# Altium project AMC_FMC_Carrier.PrjPcb (part 4 of 7)

## Sheet UI_mon.SchDoc
size A4; DocumentNumber: 28; SheetNumber: 28; SheetTotal: 30
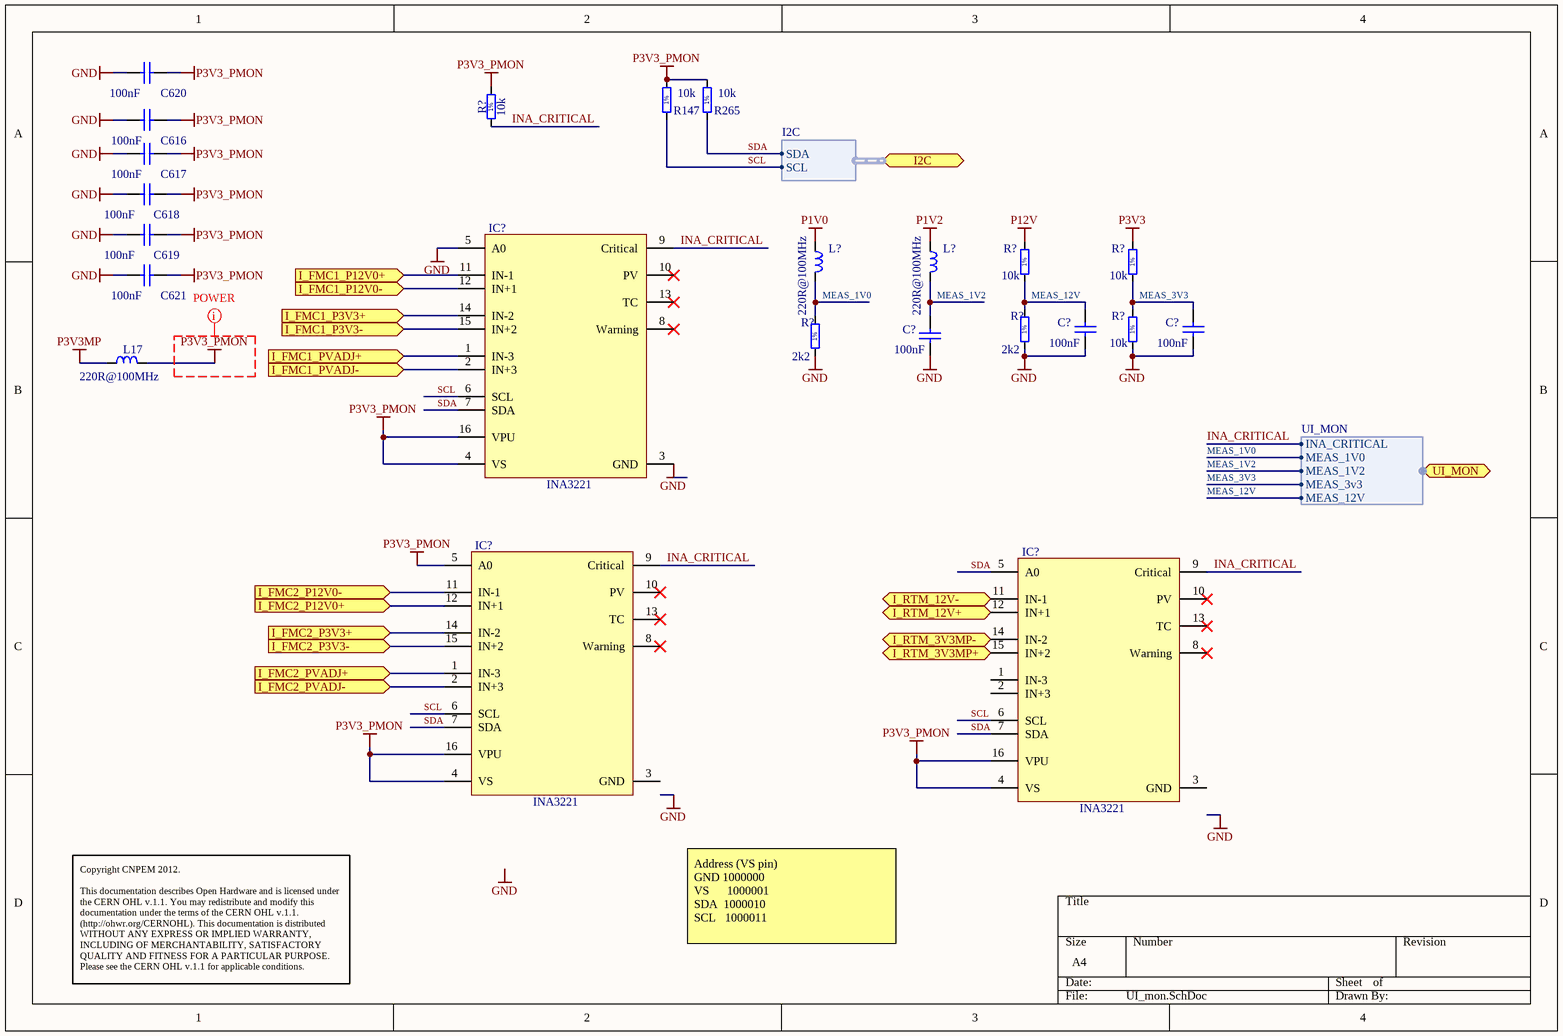
[diagram p9: UI_mon.SchDoc]

### Parts
(Parts that share a designator on the sheet are numbered #1, #2 ... from top to bottom, then left to right.)
C616  100nF  [CAPC0603X33N]
C617  100nF  [CAPC0603X33N]
C618  100nF  [CAPC0603X33N]
C619  100nF  [CAPC0603X33N]
C620  100nF  [CAPC0603X33N]
C621  100nF  [CAPC0603X33N]
C?#1  100nF  [CAPC0603X33N]
C?#2  100nF  [CAPC0603X33N]
C?#3  100nF  [CAPC0603X33N]
IC?#2  INA3221  [PQFN65P400X400X150-17N-S243]
IC?#3  INA3221  [PQFN65P400X400X150-17N-S243]
IC?#4  INA3221  [PQFN65P400X400X150-17N-S243]
L17  220R@100MHz  [INDC2012X105N]
L?#1  220R@100MHz  [INDC2012X105N]
L?#2  220R@100MHz  [INDC2012X105N]
R147  10k  [RESC1005X40N]
R265  10k  [RESC1005X40N]
R?#5  10k  [RESC1608X55N]
R?#6  10k  [RESC1005X40N]
R?#7  10k  [RESC1005X40N]
R?#8  2k2  [RESC1005X40N]
R?#9  10k  [RESC1005X40N]
R?#10  2k2  [RESC1005X40N]

### Ports
I2C (harness I2C), I_FMC1_P3V3+ (in), I_FMC1_P3V3- (in), I_FMC1_P12V0+ (in), I_FMC1_P12V0- (in), I_FMC1_PVADJ+ (in), I_FMC1_PVADJ- (in), I_FMC2_P3V3+ (in), I_FMC2_P3V3- (in), I_FMC2_P12V0+ (in), I_FMC2_P12V0- (in), I_FMC2_PVADJ+ (in), I_FMC2_PVADJ- (in), I_RTM_3V3MP+ (in), I_RTM_3V3MP- (in), I_RTM_12V+ (in), I_RTM_12V- (in), UI_MON (harness UI_MON)

### Harnesses
I2C: SCL, SDA
UI_MON: INA_CRITICAL, MEAS_1V0, MEAS_12V, MEAS_1V2, MEAS_3v3

### Nets
GND: C616.2 C617.2 C618.2 C619.2 C620.2 C621.2 C?#1.1 C?#2.1 C?#3.1 IC?#2.3(GND) IC?#2.5(A0) R?#8.1 R?#9.1 R?#10.1
P1V0: L?#1.1
P1V2: L?#2.1
P3V3: R?#7.2
P3V3_PMON: C616.1 C617.1 C618.1 C619.1 C620.1 C621.1 IC?#2.4(VS) IC?#2.16(VPU) IC?#3.4(VS) IC?#3.5(A0) IC?#3.16(VPU) IC?#4.4(VS) IC?#4.16(VPU) L17.2 R147.2 R265.2 R?#5.2
P3V3MP: L17.1
P12V: R?#6.2
I_FMC1_P3V3n: IC?#2.15(IN+2) ; port I_FMC1_P3V3-
I_FMC1_P3V3p: IC?#2.14(IN-2) ; port I_FMC1_P3V3+
I_FMC1_P12V0+: IC?#2.11(IN-1) ; port I_FMC1_P12V0+
I_FMC1_P12V0-: IC?#2.12(IN+1) ; port I_FMC1_P12V0-
I_FMC1_PADJn: IC?#2.2(IN+3) ; port I_FMC1_PVADJ-
I_FMC1_PADJp: IC?#2.1(IN-3) ; port I_FMC1_PVADJ+
I_FMC2_P3V3n: IC?#3.15(IN+2) ; port I_FMC2_P3V3-
I_FMC2_P3V3p: IC?#3.14(IN-2) ; port I_FMC2_P3V3+
I_FMC2_P12V0+: IC?#3.12(IN+1) ; port I_FMC2_P12V0+
I_FMC2_P12V0-: IC?#3.11(IN-1) ; port I_FMC2_P12V0-
I_FMC2_PADJn: IC?#3.2(IN+3) ; port I_FMC2_PVADJ-
I_FMC2_PADJp: IC?#3.1(IN-3) ; port I_FMC2_PVADJ+
I_RTM_P3V3MP+: IC?#4.15(IN+2) ; port I_RTM_3V3MP+
I_RTM_P3V3MP-: IC?#4.14(IN-2) ; port I_RTM_3V3MP-
I_RTM_P12V+: IC?#4.12(IN+1) ; port I_RTM_12V+
I_RTM_P12V-: IC?#4.11(IN-1) ; port I_RTM_12V-
INA_CRITICAL: IC?#2.9(Critical) IC?#3.9(Critical) IC?#4.9(Critical) R?#5.1 ; port UI_MON.INA_CRITICAL  [project net UI_MON.INA_CRITICAL]
MEAS_1V0: L?#1.2 R?#10.2 ; port UI_MON.MEAS_1V0  [project net UI_MON.MEAS_1V0]
MEAS_1V2: C?#3.2 L?#2.2 ; port UI_MON.MEAS_1V2  [project net UI_MON.MEAS_1V2]
MEAS_3V3: C?#2.2 R?#7.1 R?#9.2 ; port UI_MON.MEAS_3v3  [project net UI_MON.MEAS_3v3]
MEAS_12V: C?#1.2 R?#6.1 R?#8.2 ; port UI_MON.MEAS_12V  [project net UI_MON.MEAS_12V]
SCL: IC?#2.6(SCL) IC?#3.6(SCL) IC?#4.6(SCL) R147.1 ; port I2C.SCL  [project net I2C_CPU.SCL]
SDA: IC?#2.7(SDA) IC?#3.7(SDA) IC?#4.5(A0) IC?#4.7(SDA) R265.1 ; port I2C.SDA  [project net I2C_CPU.SDA]

Not connected (* = marked no-connect by the designer): IC?#2 8(Warning)* 10(PV)* 13(TC)*; IC?#3 3(GND) 8(Warning)* 10(PV)* 13(TC)*; IC?#4 1(IN-3) 2(IN+3) 3(GND) 8(Warning)* 10(PV)* 13(TC)*

### Layout directives
net class POWER: P3V3_PMON

### Notes on the sheet
- Copyright CNPEM 2012.
  This documentation describes Open Hardware and is licensed under the CERN OHL v.1.1. You may redistribute and modify this documentation under the terms of the CERN OHL v.1.1. (http://ohwr.org/CERNOHL). This documentation is distributed WITHOUT ANY EXPRESS OR IMPLIED WARRANTY, INCLUDING OF MERCHANTABILITY, SATISFACTORY QUALITY AND FITNESS FOR A PARTICULAR PURPOSE. Please see the CERN OHL v.1.1 for applicable conditions.
- Address (VS pin)
  GND 1000000
  VS      1000001
  SDA  1000010
  SCL   1000011
- Labels drawn without touching a wire or pin: GND
- (in symbol R0402_2K2_1%_0.0625W_100PPM) 1%
- (in symbol R0402_10K_1%_0.0625W_100PPM) 1%
- (in symbol R0603_10K_1%_0.1W_100PPM) 1%

### Library data of the parts
C616-C621 C?#1-C?#3 = CC0201_100NF_6.3V_10%_X5R: Non-polarised capacitor; Part Description: SMD Multilayer Chip Ceramic Capacitor; Manufacturer: GENERIC; Manufacturer1 Part Number: 02016D104KAT2A; Voltage: 6.3V; TC: X5R; Tolerance: ±10%; Table: Capacitors SMD; Part Number: CC0201_100NF_6.3V_10%_X5R; Component Kind: Standard; Component Type: Standard; Pin Count: 2; Value: 100nF; Status: Not Recommended; Manufacturer Part Number: CC0201_100NF_6.3V_10%_X5R; Case: 0201; Mounted: Yes; Socket: No; SMD: Yes; Manufacturer1 Example: AVX; Manufacturer1 ComponentHeight: 0.33mm; HelpURL: \\cern.ch\dfs\Applications\Altium\Datasheets\CC0201_X5R_AVX.pdf; Author: CERN DEM JLC; CreateDate: 2007-12-03; LatestRevisionDate: 2007-12-03
IC?#2-IC?#4 = INA3221: Triple-Channel, High-Side Measurement, Shunt and Bus Voltage Monitor  with I  2C™ Interface
L17 = IND0805_MURATA_BLM21PG221SN1D: Inductor; Part Description: SMD EMIFIL Suppression Chip Bead Ferrite; Manufacturer: MURATA; Power: 2A; Resistance: 0.05R; Tolerance: ±25%; Table: Inductors SMD; Part Number: IND0805_MURATA_BLM21PG221SN1D; Component Kind: Standard; Component Type: Standard; Pin Count: 2; Value: 220R@100MHz; Status: None; Manufacturer Part Number: BLM21PG221SN1D; Case: 0805; Mounted: Yes; Socket: No; SMD: Yes; ComponentHeight: 1.05mm; HelpURL: \\cern.ch\dfs\Applications\Altium\Datasheets\IND0402_MURATA_BLM21P.pdf; Author: CERN DEM JLC; CreateDate: 25/01/2010; LatestRevisionDate: 25/01/2010
L?#1 L?#2 = IND0805_MURATA_BLM21PG221SN1D: Inductor; Part Description: SMD EMIFIL Suppression Chip Ferrite Bead; Manufacturer: MURATA; Power: 2A; Resistance: 0.05R; Tolerance: ±25%; Table: Inductors SMD; Part Number: IND0805_MURATA_BLM21PG221SN1D; Component Kind: Standard; Component Type: Standard; Pin Count: 2; Value: 220R@100MHz; Status: None; Manufacturer Part Number: BLM21PG221SN1D; Case: 0805; Mounted: Yes; Socket: No; SMD: Yes; ComponentHeight: 1.05mm; HelpURL: \\cern.ch\dfs\Applications\Altium\Datasheets\IND0402_MURATA_BLM21P.pdf; Author: CERN DEM JLC; CreateDate: 2010-01-25; LatestRevisionDate: 2010-01-25
R147 R265 R?#6 R?#7 R?#9 = R0402_10K_1%_0.0625W_100PPM: Resistor - 1%; Part Description: General Purpose Thick Film Chip Resistor; Manufacturer: GENERIC; Manufacturer1 Part Number: 232270671003L; TC: ±100ppm/°C; Table: Resistors SMD; Part Number: R0402_10K_1%_0.0625W_100PPM; Component Kind: Standard; Component Type: Standard; Pin Count: 2; Value: 10k; Status: Not recommended; Power: 0.0625W; Tolerance: ±1%; Manufacturer Part Number: R0402_10K_1%_0.0625W_100PPM; Case: 0402; Mounted: Yes; Socket: No; SMD: Yes; Manufacturer1 Example: YAGEO PHYCOMP; Manufacturer1 ComponentHeight: 0.4mm; HelpURL: \\cern.ch\dfs\Applications\Altium\Datasheets\R0402_Phycomp_RC0402.pdf; Author: CERN DEM JLC; CreateDate: 2007-12-03; LatestRevisionDate: 2012-10-17
R?#5 = R0603_10K_1%_0.1W_100PPM: Resistor - 1%; Part Description: General Purpose Thick Film Chip Resistor; Manufacturer: GENERIC; Manufacturer1 Part Number: NRC06F1002TRF; Power: 0.1W; TC: ±100ppm/°C; Part Number: R0603_10K_1%_0.1W_100PPM; Component Kind: Standard; Component Type: Standard; Pin Count: 2; Value: 10k; Status: Preferred; Tolerance: ±1%; Manufacturer Part Number: R0603_10K_1%_0.1W_100PPM; Case: 0603; Mounted: Yes; Sense: No; Socket: No; SMD: Yes; Manufacturer1 Example: NIC COMPONENT; Manufacturer1 ComponentHeight: 0.55mm; HelpURL: \\cern.ch\dfs\Applications\Altium\Datasheets\R0603_NIC_NRC.pdf; Author: CERN DEM JLC; CreateDate: 03/12/2007; LatestRevisionDate: 13/03/2008
R?#8 R?#10 = R0402_2K2_1%_0.0625W_100PPM: Resistor - 1%; Part Description: General Purpose Thick Film Chip Resistor; Manufacturer: GENERIC; Manufacturer1 Part Number: 232270672202L; TC: ±100ppm/°C; Table: Resistors SMD; Part Number: R0402_2K2_1%_0.0625W_100PPM; Component Kind: Standard; Component Type: Standard; Pin Count: 2; Value: 2k2; Status: Not recommended; Power: 0.0625W; Tolerance: ±1%; Manufacturer Part Number: R0402_2K2_1%_0.0625W_100PPM; Case: 0402; Mounted: Yes; Socket: No; SMD: Yes; Manufacturer1 Example: YAGEO PHYCOMP; Manufacturer1 ComponentHeight: 0.4mm; HelpURL: \\cern.ch\dfs\Applications\Altium\Datasheets\R0402_Phycomp_RC0402.pdf; Author: CERN DEM JLC; CreateDate: 2007-12-03; LatestRevisionDate: 2012-10-17

## Sheet Connector_Power.SchDoc
size A4; PageSetup: Record=PageOptions|CenterHorizontal=True|CenterVertical=True|PrintScale=1.00|XCorrection=1.00|YCorrection=1.00|PrintKind=1|BorderSize=5000000|LeftOffset=0|BottomOffset=0|Orientation=2|PaperLength=1000|PaperWidth=1000|Scale=100|PaperSource=7|PrintQuality=-3|MediaType=1|DitherType=10|PrintScaleMode=1|PaperKind=A4|PaperIndex=9
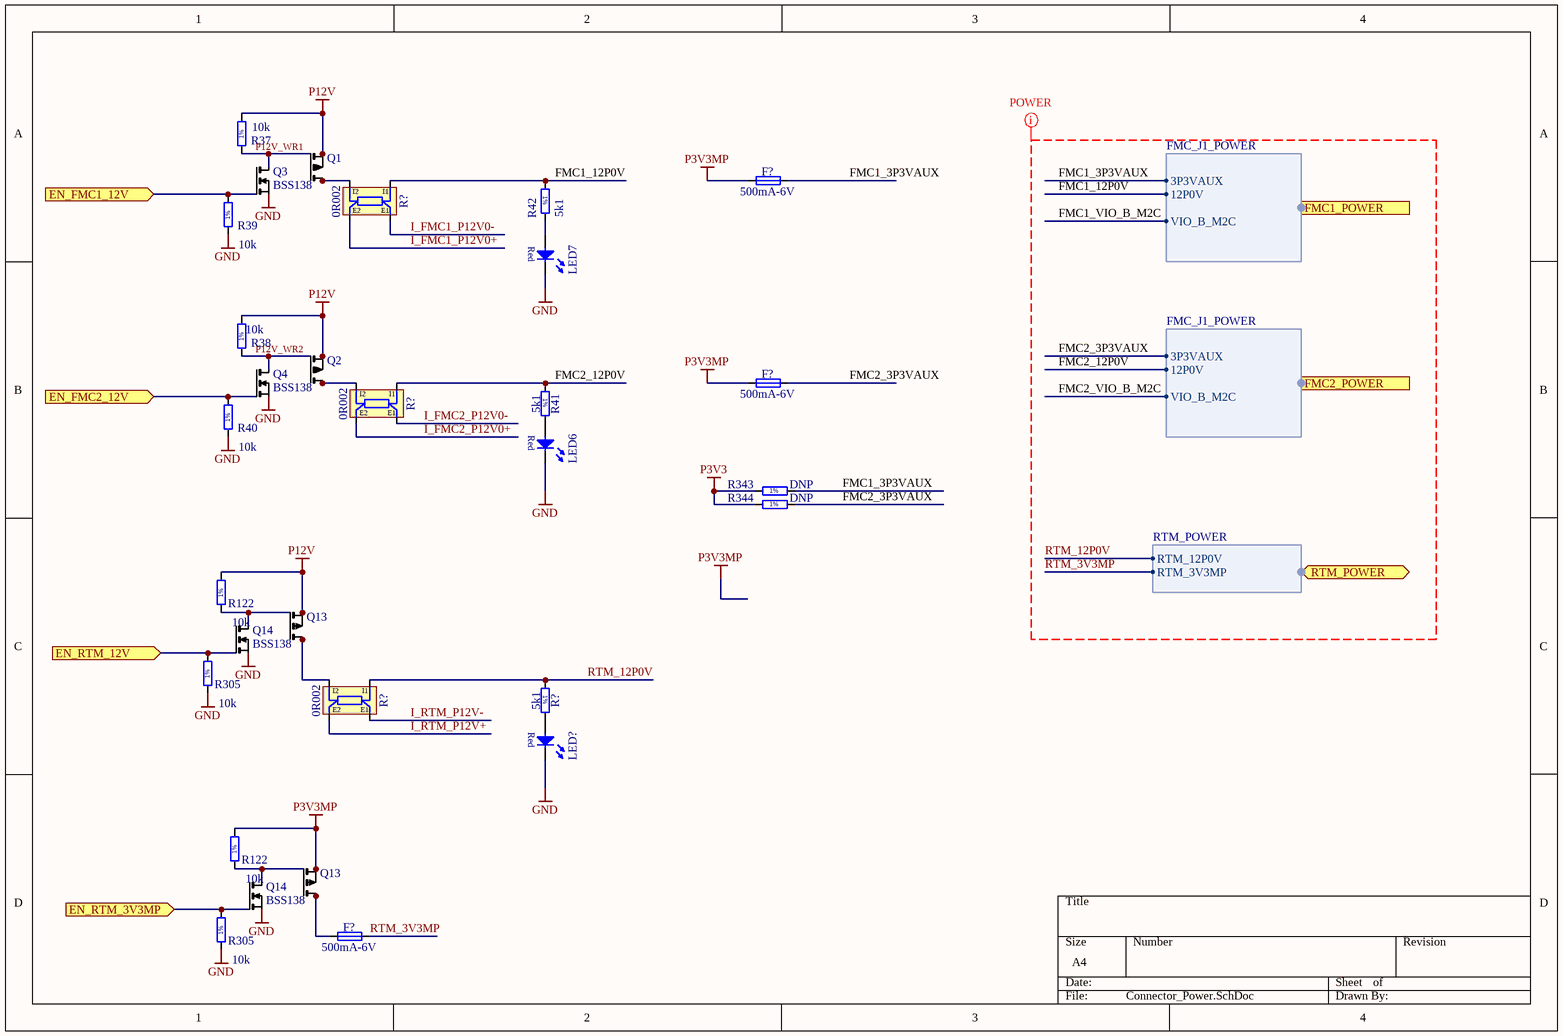
[diagram p10: Connector_Power.SchDoc]

### Parts
(Parts that share a designator on the sheet are numbered #1, #2 ... from top to bottom, then left to right.)
F?#2  500mA-6V  [FUSR_BOURNS_MF-PSMF050]
F?#3  500mA-6V  [FUSR_BOURNS_MF-PSMF050]
F?#4  500mA-6V  [FUSR_BOURNS_MF-PSMF050]
LED6#3  Red  [LED_AVAGO_HSMC-C150]  (value not drawn)
LED7  Red  [LED_AVAGO_HSMC-C150]  (value not drawn)
LED?  Red  [LED_AVAGO_HSMC-C150]  (value not drawn)
Q1  IRF9317PBF  or IRF9310PbF  [so-8]  (value not drawn)
Q2  IRF9317PBF  or IRF9310PbF  [so-8]  (value not drawn)
Q3  BSS138  [SOT95P251X112-3N]
Q4  BSS138  [SOT95P251X112-3N]
Q13#1  IRF9317PBF  or IRF9310PbF  [so-8]  (value not drawn)
Q13#2  IRF9317PBF  or IRF9310PbF  [so-8]  (value not drawn)
Q14#1  BSS138  [SOT95P251X112-3N]
Q14#2  BSS138  [SOT95P251X112-3N]
R37  10k  [RESC1005X40N]
R38  10k  [RESC1005X40N]
R39  10k  [RESC1005X40N]
R40  10k  [RESC1005X40N]
R41  5k1  [RESC1608X55N]
R42  5k1  [RESC1608X55N]
R122#1  10k  [RESC1005X40N]
R122#2  10k  [RESC1005X40N]
R305#1  10k  [RESC1005X40N]
R305#2  10k  [RESC1005X40N]
R343  DNP  [RESC1005X40N]
R344  DNP  [RESC1005X40N]
R?#11  0R002  [RES_VISHAY_WSL3637_0R002-0R01]
R?#12  0R002  [RES_VISHAY_WSL3637_0R002-0R01]
R?#13  5k1  [RESC1608X55N]
R?#14  0R002  [RES_VISHAY_WSL3637_0R002-0R01]

### Ports
EN_FMC1_12V (in), EN_FMC2_12V (in), EN_RTM_3V3MP (in), EN_RTM_12V (in), FMC1_POWER (harness FMC_J1_POWER), FMC2_POWER (harness FMC_J1_POWER), RTM_POWER (harness RTM_POWER)

### Harnesses
FMC_J1_POWER: 3P3VAUX, 12P0V, VIO_B_M2C
RTM_POWER: RTM_12P0V, RTM_3V3MP

### Nets
GND: LED6#3.1(C) LED7.1(C) LED?.1(C) Q3.2(S) Q4.2(S) Q14#1.2(S) Q14#2.2(S) R39.1 R40.1 R305#1.1 R305#2.1
P3V3: R343.1 R344.1
P3V3MP: F?#2.1 F?#3.1 Q13#2.1(S1) Q13#2.2(S1) Q13#2.3(S1) R122#2.2
P12V: Q1.1(S1) Q1.2(S1) Q1.3(S1) Q2.1(S1) Q2.2(S1) Q2.3(S1) Q13#1.1(S1) Q13#1.2(S1) Q13#1.3(S1) R37.2 R38.2 R122#1.2
FMC1_3P3VAUX: F?#2.2 R343.2 ; port FMC1_POWER.3P3VAUX  [project net POWER1.3P3VAUX]
FMC1_12P0V: R42.1 R?#11.I1 ; port FMC1_POWER.12P0V  [project net POWER1.12P0V]
FMC1_VIO_B_M2C: port FMC1_POWER.VIO_B_M2C  [project net POWER1.VIO_B_M2C]
FMC2_3P3VAUX: F?#3.2 R344.2 ; port FMC2_POWER.3P3VAUX  [project net POWER2.3P3VAUX]
FMC2_12P0V: R41.1 R?#12.I1 ; port FMC2_POWER.12P0V  [project net POWER2.12P0V]
FMC2_VIO_B_M2C: port FMC2_POWER.VIO_B_M2C  [project net POWER2.VIO_B_M2C]
I_FMC1_P12V0+: R?#11.E2
I_FMC1_P12V0-: R?#11.E1
I_FMC2_P12V0+: R?#12.E2
I_FMC2_P12V0-: R?#12.E1
I_RTM_P12V+: R?#14.E2
I_RTM_P12V-: R?#14.E1
P12V_WR1: Q1.4(G1) Q3.3(D) R37.1
P12V_WR2: Q2.4(G1) Q4.3(D) R38.1
PM.EN_FMC1_P12V: Q3.1(G) R39.2 ; port EN_FMC1_12V
PM.EN_FMC2_P12V: Q4.1(G) R40.2 ; port EN_FMC2_12V
PM.EN_RTM_3V3MP: Q14#2.1(G) R305#2.2 ; port EN_RTM_3V3MP
PM.EN_RTM_PWR: Q14#1.1(G) R305#1.2 ; port EN_RTM_12V
RTM_3V3MP: F?#4.2 ; port RTM_POWER.RTM_3V3MP
RTM_12P0V: R?#13.1 R?#14.I1 ; port RTM_POWER.RTM_12P0V
NetF?#4_1: F?#4.1 Q13#2.5(D1) Q13#2.6(D1) Q13#2.7(D1) Q13#2.8(D1)
NetLED6#3_2: LED6#3.2(A) R41.2
NetLED7_2: LED7.2(A) R42.2
NetLED?_2: LED?.2(A) R?#13.2
NetQ1_5: Q1.5(D1) Q1.6(D1) Q1.7(D1) Q1.8(D1) R?#11.I2
NetQ2_5: Q2.5(D1) Q2.6(D1) Q2.7(D1) Q2.8(D1) R?#12.I2
NetQ13#1_4: Q13#1.4(G1) Q14#1.3(D) R122#1.1
NetQ13#1_5: Q13#1.5(D1) Q13#1.6(D1) Q13#1.7(D1) Q13#1.8(D1) R?#14.I2
NetQ13#2_4: Q13#2.4(G1) Q14#2.3(D) R122#2.1

### Layout directives
net class POWER: FMC1_3P3VAUX, FMC1_12P0V, FMC1_VIO_B_M2C, FMC2_3P3VAUX, FMC2_12P0V, FMC2_VIO_B_M2C, RTM_3V3MP, RTM_12P0V

### Notes on the sheet
- (in symbol R0402_0R_JUMPER) 1%
- (in symbol R0402_10K_1%_0.0625W_100PPM) 1%
- (in symbol R0603_5K1_1%_0.1W_100PPM) 1%

### Library data of the parts
F?#2-F?#4 = FUSR_BOURNS_MF-PSMF050X-2: Fuse; Part Description: PTC Resettable Fuse; Manufacturer: BOURNS; PressFit: No; Part Number: FUSR_BOURNS_MF-PSMF050X-2; Component Kind: Standard; Component Type: Standard; Pin Count: 2; PackageDescription: PTC Resettable Fuse, MF-PSMS Series, Height 0.48mm; Family: Fuses Resettable; Mounted: Yes; Socket: No; SMD: Yes; Sense: No; Value: 500mA-6V; Manufacturer Part Number: MF-PSMF050X-2; ComponentHeight: 0.48mm; HelpURL: \\cern.ch\dfs\Applications\Altium\Datasheets\FUSR_BOURNS_MF-PSMF.pdf; Author: CERN DEM MR; CreateDate: 02/12/2015; LatestRevisionDate: 02/12/2015
LED6#3 LED7 LED? = LED_AVAGO_HSMC-C150: LED Red 1C 2A; Part Description: Surface Mount Red LED (1206 Case); Manufacturer: AVAGO TECHNOLOGIES; PressFit: No; Bonding: No; Part Number: LED_AVAGO_HSMC-C150; Component Kind: Standard; Component Type: Standard; Color: Red; PackageDescription: Red Chip LED, 2-Leads, Body 3.2 x1.6mm, IPC Medium Density; Manufacturer Part Number: HSMC-C150; Pin Count: 2; Case: 1206; Mounted: Yes; Socket: No; SMD: Yes; Sense: No; ComponentHeight: 1.2mm; HelpURL: \\cern.ch\dfs\Applications\Altium\Datasheets\LED_AVAGO_HSMC-C150.pdf; Author: CERN DEM JLC; CreateDate: 18/06/2013; LatestRevisionDate: 18/06/2013
Q1 Q2 Q13#1 Q13#2 = Q_IRF9310: PMOS 30V, 4.6mR, 20A, 2.5W
Q3 Q4 Q14#1 Q14#2 = Q_BSS138
R37-R40 R122#1 R122#2 R305#1 R305#2 = R0402_10K_1%_0.0625W_100PPM: as R147 on sheet UI_mon; Part Number: R0402_10K_1%_0.0625W_100PPM; Component Kind: Standard; Component Type: Standard; Pin Count: 2; Value: 10k; Status: Not recommended; Power: 0.0625W; Tolerance: ±1%; Manufacturer Part Number: R0402_10K_1%_0.0625W_100PPM; Case: 0402; Mounted: Yes; Socket: No; SMD: Yes; Manufacturer1 Example: YAGEO PHYCOMP; Manufacturer1 ComponentHeight: 0.4mm; HelpURL: \\cern.ch\dfs\Applications\Altium\Datasheets\R0402_Phycomp_RC0402.pdf; Author: CERN DEM JLC; CreateDate: 2007-12-03; LatestRevisionDate: 2012-10-17
R41 R42 R?#13 = R0603_5K1_1%_0.1W_100PPM: Resistor - 1%; Part Description: General Purpose Thick Film Chip Resistor; Manufacturer: GENERIC; Manufacturer1 Part Number: NRC06F5101TRF; Power: 0.1W; TC: ±100ppm/°C; Table: Resistors SMD; Part Number: R0603_5K1_1%_0.1W_100PPM; Component Kind: Standard; Component Type: Standard; Pin Count: 2; Value: 5k1; Status: Preferred; Tolerance: ±1%; Manufacturer Part Number: R0603_5K1_1%_0.1W_100PPM; Case: 0603; Mounted: Yes; Socket: No; SMD: Yes; Manufacturer1 Example: NIC COMPONENT; Manufacturer1 ComponentHeight: 0.55mm; HelpURL: \\cern.ch\dfs\Applications\Altium\Datasheets\R0603_NIC_NRC.pdf; Author: CERN DEM JLC; CreateDate: 2007-12-03; LatestRevisionDate: 2008-03-13
R343 R344 = R0402_0R_JUMPER: Resistor - 1%; Part Description: 1A (0.05R Max DC Resistance) Zero Ohm Jumper; Manufacturer: GENERIC; Manufacturer1 Part Number: 232270591001L; Value: 0; Table: Resistors SMD; Part Number: R0402_0R_JUMPER; Component Kind: Standard; Component Type: Standard; Pin Count: 2; Status: Not recommended; Manufacturer Part Number: R0402_0R_JUMPER; Case: 0402; Mounted: Yes; Socket: No; SMD: Yes; Manufacturer1 Example: YAGEO PHYCOMP; Manufacturer1 ComponentHeight: 0.4mm; HelpURL: \\cern.ch\dfs\Applications\Altium\Datasheets\R0402_Phycomp_RC0402.pdf; Author: CERN DEM JLC; CreateDate: 2007-12-03; LatestRevisionDate: 2012-10-17
R?#11 R?#12 R?#14 = R3637_0R002_1%_3W_50PPM_VISHAY_WSL3637: Power and Current Sensing Resistor; Part Description: Power Metal Strip® Resistor, Low Value; Manufacturer: VISHAY DALE; Manufacturer Part Number: WSL36372L000FEA; Power: 3W; TC: ±75ppm/°C; Tolerance: ±1%; Part Number: R3637_0R002_1%_3W_50PPM_VISHAY_WSL3637; Component Kind: Standard; Component Type: Standard; Pin Count: 2; Value: 0R002; Status: None; Case: 3637; Mounted: Yes; Sense: No; Socket: No; SMD: Yes; ComponentHeight: 0.89mm; HelpURL: \\cern.ch\dfs\Applications\Altium\Datasheets\R3637_VISHAY_WSL3637.pdf; Author: CERN DEM MR; CreateDate: 02/06/2016; LatestRevisionDate: 02/06/2016

## Sheet IPMI.SchDoc
size A4; DocumentNumber: 5; SheetNumber: 5; SheetTotal: 30
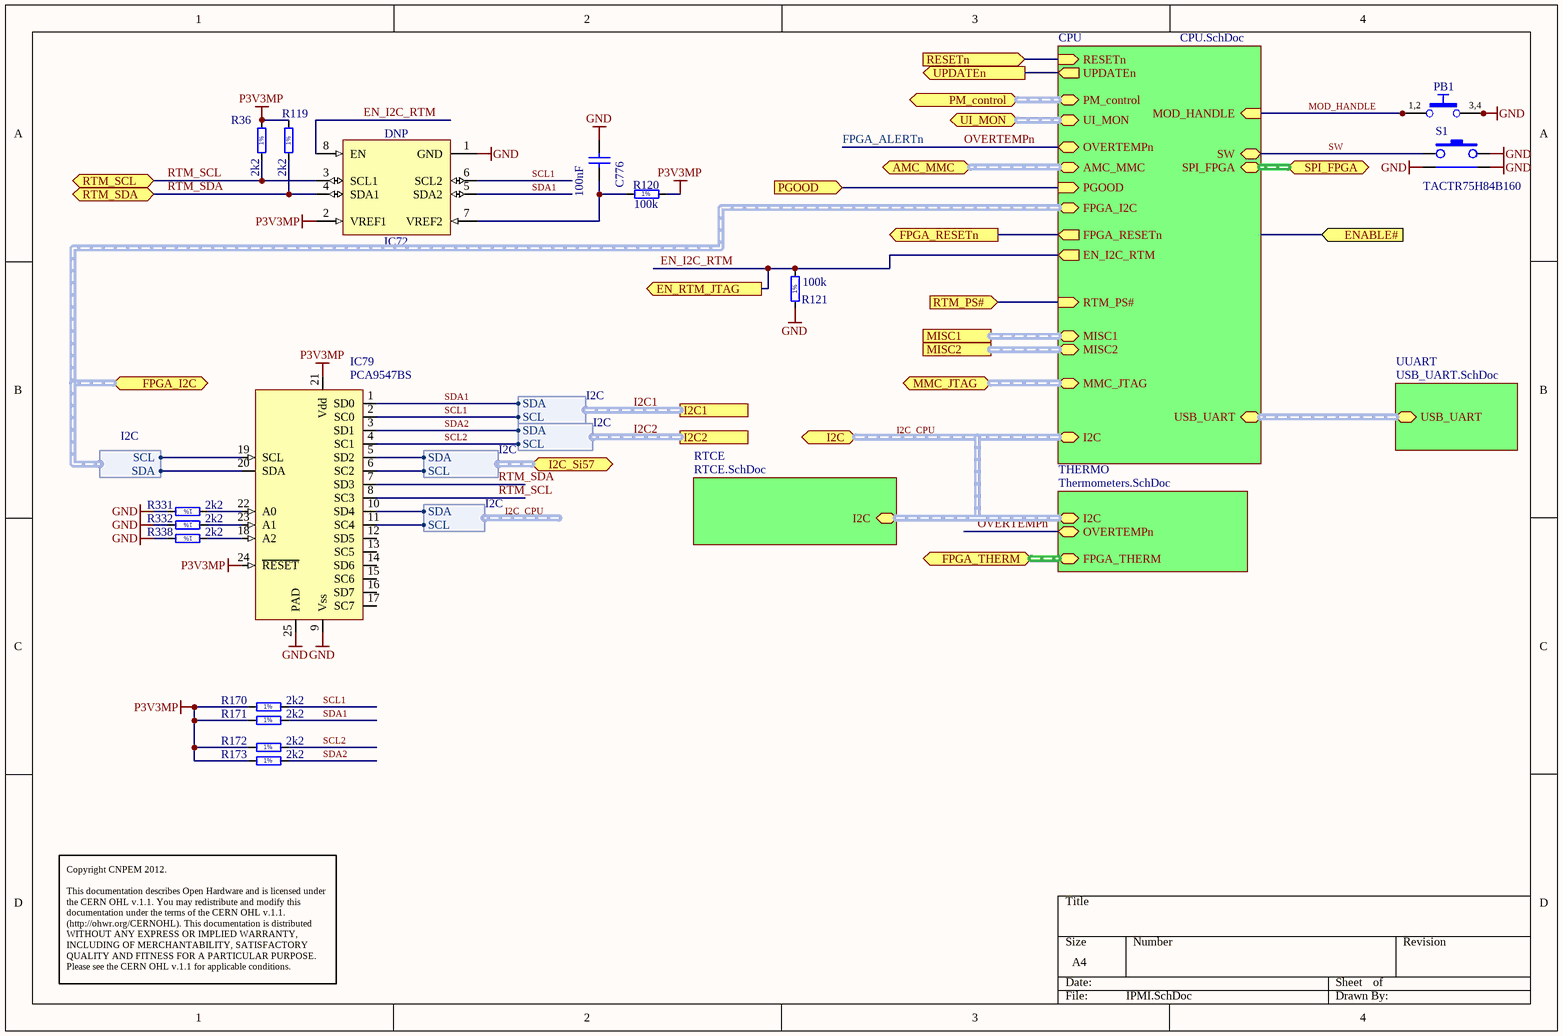
[diagram p11: IPMI.SchDoc]

### Parts
C776  100nF  [CAPC0603X33N]
IC72  DNP  [SOP65P400X130-8N]
IC79  PCA9547BS  [HVQFN24]
PB1  Push Button  [SW_C&K_HDT0001]  (value not drawn)
R36  2k2  [RESC1005X40N]
R119  2k2  [RESC1005X40N]
R120  100k  [RESC1005X40N]
R121  100k  [RESC1005X40N]
R170  2k2  [RESC1005X40N]
R171  2k2  [RESC1005X40N]
R172  2k2  [RESC1005X40N]
R173  2k2  [RESC1005X40N]
R331  2k2  [RESC1005X40N]
R332  2k2  [RESC1005X40N]
R338  2k2  [RESC1005X40N]
S1  TACTR75H84B160  [PB_ALPS_SKHHLQA010]

### Sub-sheets
CPU = CPU.SchDoc: PM_control (harness PM_control), OVERTEMPn (bidir), MOD_HANDLE (in), SPI_FPGA (harness SPI), SW, RESETn (in), UPDATEn (out), I2C (harness I2C), MISC1 (harness MISC), MISC2 (harness MISC), FPGA_RESETn (out), RTM_PS# (in), EN_I2C_RTM (out), FPGA_I2C (harness I2C), MMC_JTAG (harness MMC_JTAG), USB_UART (harness USB_UART), AMC_MMC (harness AMC_MMC), UI_MON (harness UI_MON), PGOOD (in)
RTCE = RTCE.SchDoc (file not in this document): I2C (harness I2C)
THERMO = Thermometers.SchDoc: OVERTEMPn (bidir), FPGA_THERM (harness FPGA_THERM), I2C (harness I2C)
UUART = USB_UART.SchDoc: USB_UART (harness USB_UART)

### Ports
AMC_MMC (harness AMC_MMC), EN_RTM_JTAG (out), ENABLE# (in), FPGA_I2C (harness I2C), FPGA_RESETn (out), FPGA_THERM (harness FPGA_THERM), I2C1 (harness I2C), I2C2 (harness I2C), I2C (harness I2C), I2C_Si57 (harness I2C), MISC1 (harness MISC), MISC2 (harness MISC), MMC_JTAG, PGOOD (in), PM_control (harness PM_control), RESETn (in), RTM_PS# (in), RTM_SCL (bidir), RTM_SDA (bidir), SPI_FPGA (harness SPI), UI_MON, UPDATEn (out)

### Harnesses
I2C: SCL, SDA

### Nets
GND: C776.2 IC72.1(GND) IC79.9(Vss) IC79.25(PAD) PB1.3 PB1.4 R121.1 R331.2 R332.2 R338.2 S1.2 S1.3 S1.4
P3V3MP: IC72.2(VREF1) IC79.21(Vdd) IC79.24(~{RESET}) R36.2 R119.2 R120.2 R170.1 R171.1 R172.1 R173.1
EN_I2C_RTM: IC72.8(EN) R121.2 ; port EN_RTM_JTAG, sheet CPU/EN_I2C_RTM
FPGA_ALERTn: sheet CPU/OVERTEMPn, sheet THERMO/OVERTEMPn  [also labelled OVERTEMPn]
FPGA_RESETn: port FPGA_RESETn, sheet CPU/FPGA_RESETn
FPGA_SCL: IC79.19(SCL) ; port FPGA_I2C.SCL
FPGA_SDA: IC79.20(SDA) ; port FPGA_I2C.SDA
I2C_CPU.SCL: IC79.11(SC4) ; port I2C.SCL
I2C_CPU.SDA: IC79.10(SD4) ; port I2C.SDA
I2C_Si57.SCL: IC79.6(SC2) ; port I2C_Si57.SCL
I2C_Si57.SDA: IC79.5(SD2) ; port I2C_Si57.SDA
MOD_HANDLE: PB1.1 PB1.2 ; sheet CPU/MOD_HANDLE
PGOOD: port PGOOD, sheet CPU/PGOOD
RESETn: port RESETn, sheet CPU/RESETn
RTM_PS#: port RTM_PS#, sheet CPU/RTM_PS#
RTM_SCL: IC72.3(SCL1) IC79.8(SC3) R36.1 ; port RTM_SCL
RTM_SDA: IC72.4(SDA1) IC79.7(SD3) R119.1 ; port RTM_SDA
SCL1: IC72.6(SCL2) IC79.2(SC0) R170.2 ; port I2C1.SCL  [project net I2C1.SCL]
SCL2: IC79.4(SC1) R172.2 ; port I2C2.SCL  [project net I2C2.SCL]
SDA1: IC72.5(SDA2) IC79.1(SD0) R171.2 ; port I2C1.SDA  [project net I2C1.SDA]
SDA2: IC79.3(SD1) R173.2 ; port I2C2.SDA  [project net I2C2.SDA]
SW: S1.1 ; sheet CPU/SW
UPDATEn: port UPDATEn, sheet CPU/UPDATEn
NetC776_1: C776.1 IC72.7(VREF2) R120.1
NetIC79_18: IC79.18(A2) R338.1
NetIC79_22: IC79.22(A0) R331.1
NetIC79_23: IC79.23(A1) R332.1

Not connected (* = marked no-connect by the designer): IC79 12(SD5) 13(SC5) 14(SD6) 15(SC6) 16(SD7) 17(SC7)

### Buses and harness runs
harness I2C1 = port I2C1
harness I2C2 = port I2C2
harness I2C_CPU = port I2C = sheet CPU/I2C = sheet RTCE/I2C = sheet THERMO/I2C
harness port AMC_MMC = sheet CPU/AMC_MMC
harness port FPGA_I2C = sheet CPU/FPGA_I2C
harness port FPGA_THERM = sheet THERMO/FPGA_THERM
harness port MISC1 = sheet CPU/MISC1
harness port MISC2 = sheet CPU/MISC2
harness port MMC_JTAG = sheet CPU/MMC_JTAG
harness port PM_control = sheet CPU/PM_control
harness port SPI_FPGA = sheet CPU/SPI_FPGA
harness port UI_MON = sheet CPU/UI_MON
harness sheet CPU/USB_UART = sheet UUART/USB_UART

### Notes on the sheet
- Copyright CNPEM 2012.
  This documentation describes Open Hardware and is licensed under the CERN OHL v.1.1. You may redistribute and modify this documentation under the terms of the CERN OHL v.1.1. (http://ohwr.org/CERNOHL). This documentation is distributed WITHOUT ANY EXPRESS OR IMPLIED WARRANTY, INCLUDING OF MERCHANTABILITY, SATISFACTORY QUALITY AND FITNESS FOR A PARTICULAR PURPOSE. Please see the CERN OHL v.1.1 for applicable conditions.
- (in symbol R0402_2K2_1%_0.0625W_100PPM) 1%
- (in symbol R0402_100K_1%_0.0625W_100PPM) 1%
- (in symbol SW_C&K_HDT0001) 1,2; 3,4

### Library data of the parts
C776 = CC0201_100NF_6.3V_10%_X5R: as C616-C621 on sheet UI_mon; Part Number: CC0201_100NF_6.3V_10%_X5R; Component Kind: Standard; Component Type: Standard; Pin Count: 2; Value: 100nF; Status: Not Recommended; Manufacturer Part Number: CC0201_100NF_6.3V_10%_X5R; Case: 0201; Mounted: Yes; Socket: No; SMD: Yes; Manufacturer1 Example: AVX; Manufacturer1 ComponentHeight: 0.33mm; HelpURL: \\cern.ch\dfs\Applications\Altium\Datasheets\CC0201_X5R_AVX.pdf; Author: CERN DEM JLC; CreateDate: 2007-12-03; LatestRevisionDate: 2007-12-03
IC72 = PCA9306DCTR: Dual Bidirectional I2C Bus And SMBus Voltage-Level Translator; Manufacturer: TEXAS INSTRUMENTS; Table: Analog & Interface; Part Number: PCA9306DCTR; Component Kind: Standard; Component Type: Standard; Device: PCA9306DCTR; PackageDescription: SOP, 0.65mm, Pitch; 8 Pin, 2.80mm W X 2.95mm L X 1.30mm H Body, PC Medium Density; Part Description: Dual Bidirectional I2C Bus And SMBus Voltage-Level Translator; Manufacturer Part Number: PCA9306DCTR; Pin Count: 8; Case: SSOP8; Mounted: Yes; Socket: No; SMD: Yes; ComponentHeight: 1.3mm; Author: CERN DEM JLC; HelpURL: \\cern.ch\dfs\Applications\Altium\Datasheets\PCA9306DCTR.pdf; CreateDate: 2013-02-25; LatestRevisionDate: 2013-02-25
IC79 = IIC_MUX_PCA9547: 8-channel I2C-bus multiplexer with reset
PB1 = SW_C&K_HDT0001: Push-Button Switch SPDT; Part Description: 5VDC 1mA SPST-NO Micro Mini Surface Surface Mount Detect Push-Button Switch, HDT Serie; Manufacturer: C&K; Table: Switches; Part Number: SW_C&K_HDT0001; Component Kind: Standard; Component Type: Standard; Pin Count: 4; PackageDescription: Body 3.5x2.8mm, Micro Mini Surface Mount Detect Switches, HDT Serie; Family: Push Button; Mounted: Yes; Socket: No; SMD: Yes; Status: None; Manufacturer Part Number: HDT0001; ComponentHeight: 3.35mm; HelpURL: \\cern.ch\dfs\Applications\Altium\Datasheets\SW_C&K_HDT0001.pdf; Author: CERN DEM JLC; CreateDate: 2012-08-15; LatestRevisionDate: 2012-08-15
R36 R119 R170-R173 R331 R332 R338 = R0402_2K2_1%_0.0625W_100PPM: as R?#8 on sheet UI_mon; Part Number: R0402_2K2_1%_0.0625W_100PPM; Component Kind: Standard; Component Type: Standard; Pin Count: 2; Value: 2k2; Status: Not recommended; Power: 0.0625W; Tolerance: ±1%; Manufacturer Part Number: R0402_2K2_1%_0.0625W_100PPM; Case: 0402; Mounted: Yes; Socket: No; SMD: Yes; Manufacturer1 Example: YAGEO PHYCOMP; Manufacturer1 ComponentHeight: 0.4mm; HelpURL: \\cern.ch\dfs\Applications\Altium\Datasheets\R0402_Phycomp_RC0402.pdf; Author: CERN DEM JLC; CreateDate: 2007-12-03; LatestRevisionDate: 2012-10-17
R120 R121 = R0402_100K_1%_0.0625W_100PPM: Resistor - 1%; Part Description: General Purpose Thick Film Chip Resistor; Manufacturer: GENERIC; Manufacturer1 Part Number: 232270671004L; TC: ±100ppm/°C; Table: Resistors SMD; Part Number: R0402_100K_1%_0.0625W_100PPM; Component Kind: Standard; Component Type: Standard; Pin Count: 2; Value: 100k; Status: Not recommended; Power: 0.0625W; Tolerance: ±1%; Manufacturer Part Number: R0402_100K_1%_0.0625W_100PPM; Case: 0402; Mounted: Yes; Socket: No; SMD: Yes; Manufacturer1 Example: YAGEO PHYCOMP; Manufacturer1 ComponentHeight: 0.4mm; HelpURL: \\cern.ch\dfs\Applications\Altium\Datasheets\R0402_Phycomp_RC0402.pdf; Author: CERN DEM JLC; CreateDate: 2007-12-03; LatestRevisionDate: 2012-10-17
S1 = SW-PB_RA_5.8mm: Push button

## Sheet CPU.SchDoc
size A3; DocumentNumber: 11; SheetNumber: 11; SheetTotal: 30
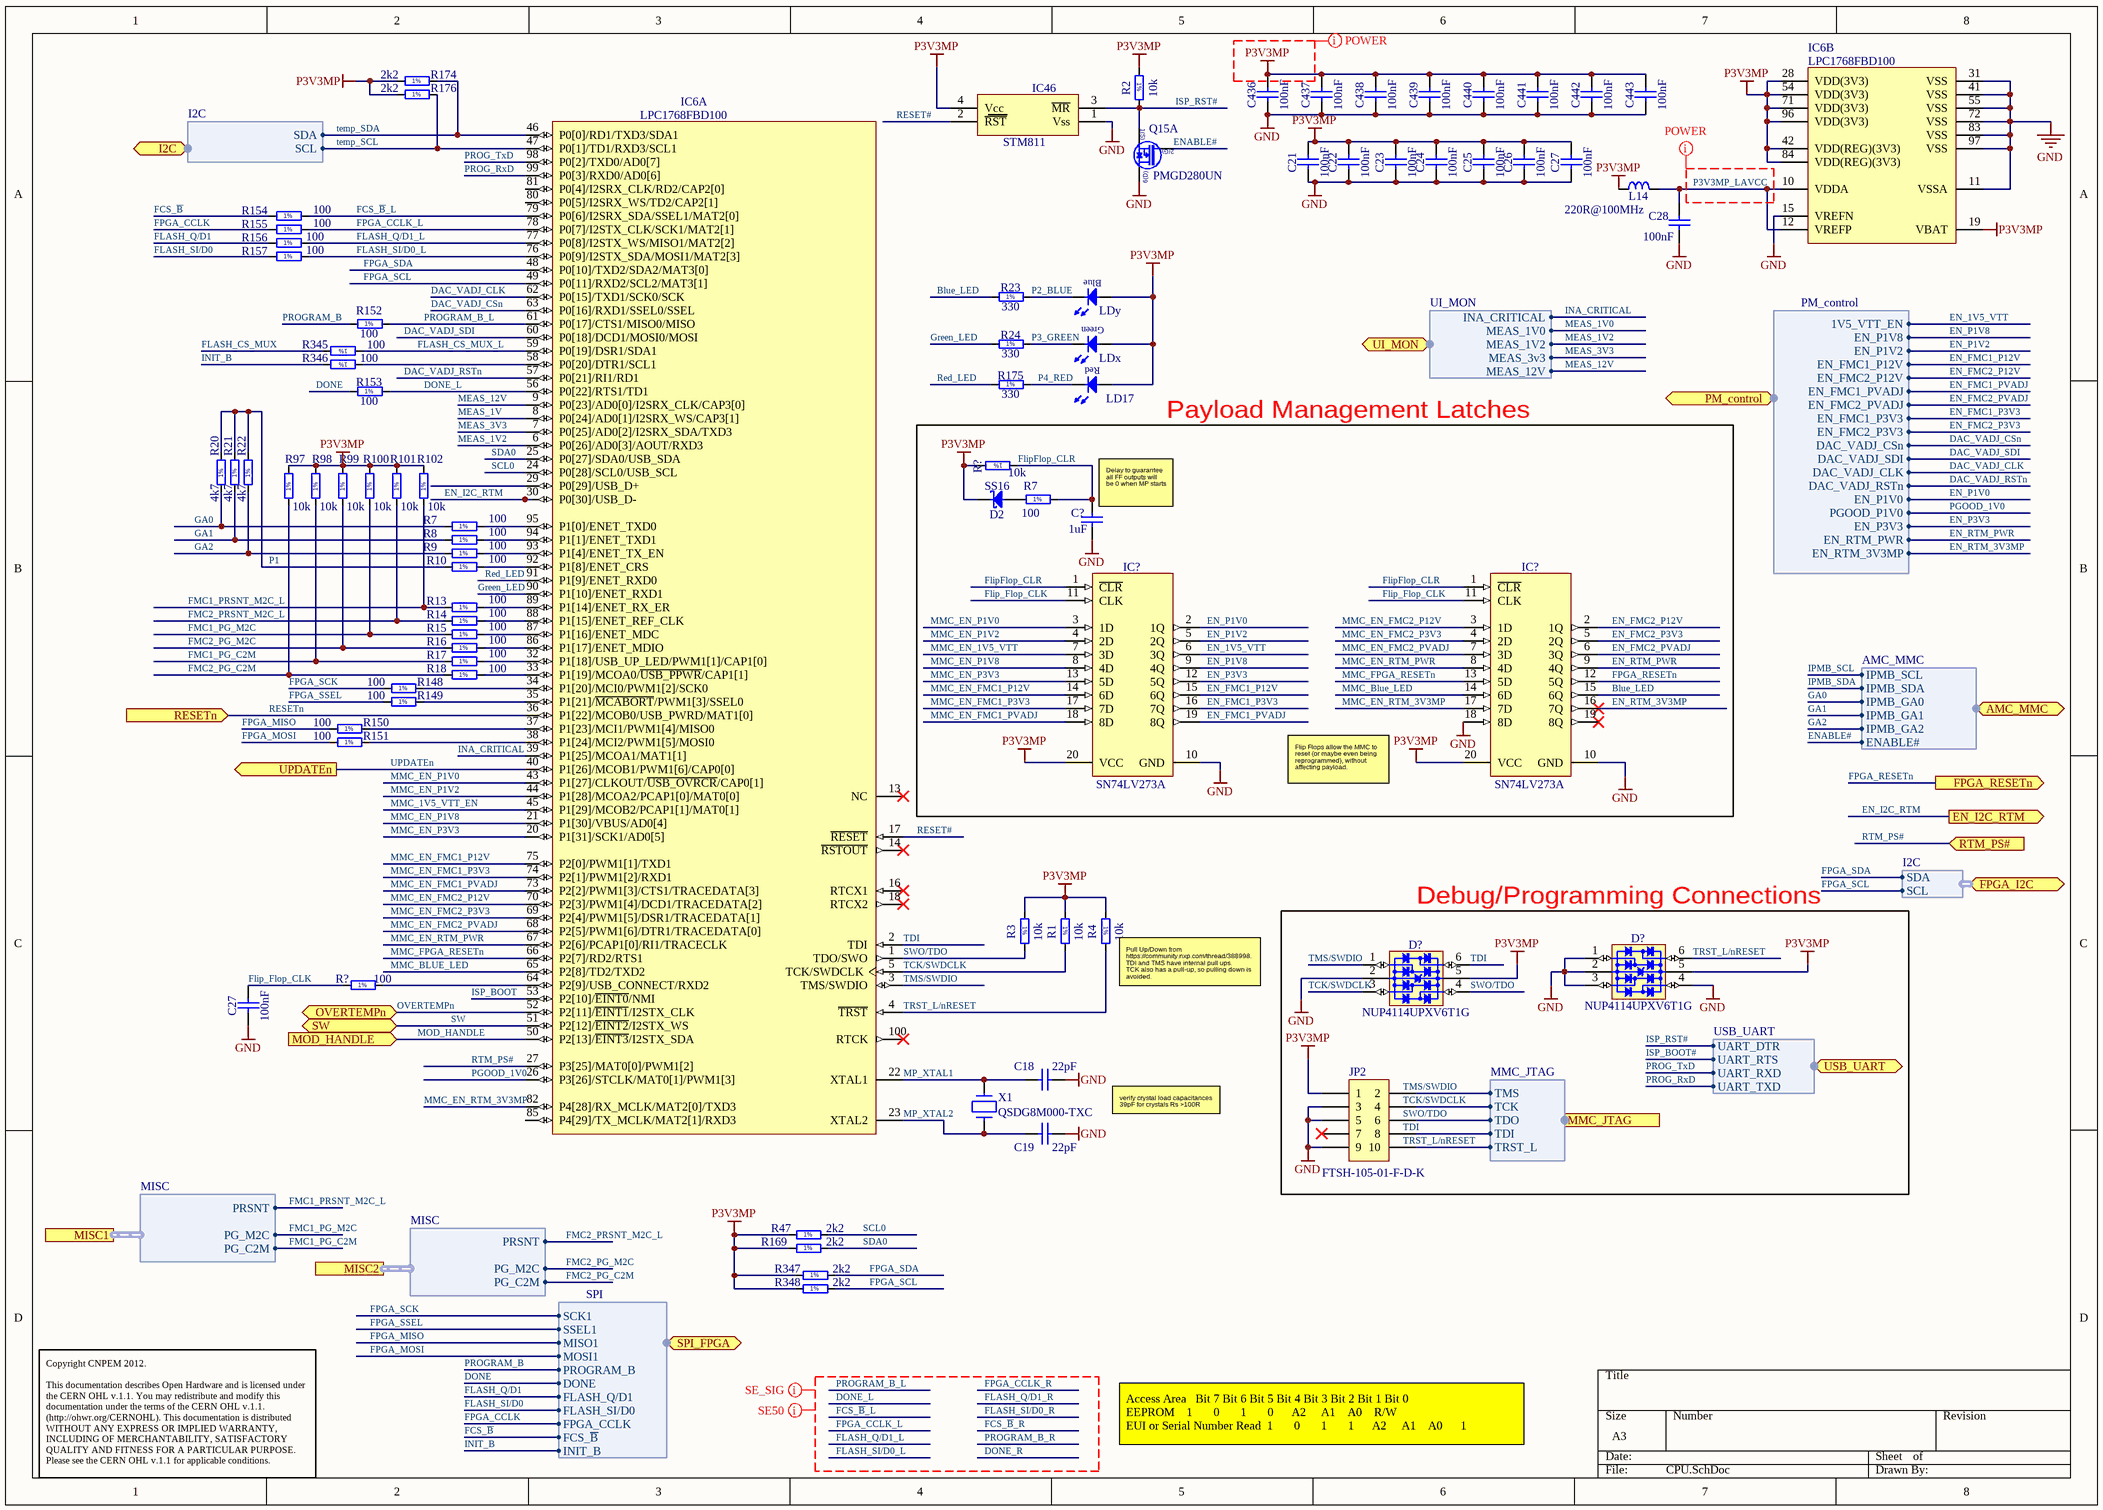
[diagram p12: CPU.SchDoc]

### Parts
(Parts that share a designator on the sheet are numbered #1, #2 ... from top to bottom, then left to right.)
C18  22pF  [CAPC1005X55N]
C19  22pF  [CAPC1005X55N]
C21  100nF  [CAPC0603X33N]
C22  100nF  [CAPC0603X33N]
C23  100nF  [CAPC0603X33N]
C24  100nF  [CAPC0603X33N]
C25  100nF  [CAPC0603X33N]
C26  100nF  [CAPC0603X33N]
C27#1  100nF  [CAPC0603X33N]
C27#2  100nF  [CAPC0603X33N]
C28  100nF  [CAPC0603X33N]
C436  100nF  [CAPC0603X33N]
C437  100nF  [CAPC0603X33N]
C438  100nF  [CAPC0603X33N]
C439  100nF  [CAPC0603X33N]
C440  100nF  [CAPC0603X33N]
C441  100nF  [CAPC0603X33N]
C442  100nF  [CAPC0603X33N]
C443  100nF  [CAPC0603X33N]
C?#4  1uF  [CAPC1608X87N]
D2#2  SS16  [DIOM5127X229N]
D?#5  NUP4114UPXV6T1G  [SOTFL50P160X60-6N]
D?#6  NUP4114UPXV6T1G  [SOTFL50P160X60-6N]
IC6  LPC1768FBD100  [QFP50P1600X1600X160-100N]  (parts A,B of 2)
IC46  STM811
IC?#5  SN74LV273A  [SOIC127P600X175-16N]
IC?#6  SN74LV273A  [SOIC127P600X175-16N]
JP2  FTSH-105-01-F-D-K  [CON_2x5_MINI]
L14  220R@100MHz  [INDC2012X105N]
LD17  Red  [LED_AVAGO_HSMC-C150]  (value not drawn)
LDx  Green  [LED_AVAGO_HSME-C120rev]  (value not drawn)
LDy  Blue  [LED_AVAGO_HSME-C120rev]  (value not drawn)
Q15  PMGD280UN  [SOT65P210X110-6N]  (part A of 2)
R1  10k  [RESC1005X40N]
R2  10k  [RESC1005X40N]
R3  10k  [RESC1005X40N]
R4  10k  [RESC1005X40N]
R7#1  100  [RESC1005X40N]
R7#2  100  [RESC1005X40N]
R8  100  [RESC1005X40N]
R9  100  [RESC1005X40N]
R10  100  [RESC1005X40N]
R13  100  [RESC1005X40N]
R14  100  [RESC1005X40N]
R15  100  [RESC1005X40N]
R16  100  [RESC1005X40N]
R17  100  [RESC1005X40N]
R18  100  [RESC1005X40N]
R20  4k7  [RESC1005X40N]
R21  4k7  [RESC1005X40N]
R22  4k7  [RESC1005X40N]
R23  330  [RESC1005X40N]
R24  330  [RESC1005X40N]
R47  2k2  [RESC1005X40N]
R97  10k  [RESC1005X40N]
R98  10k  [RESC1005X40N]
R99  10k  [RESC1005X40N]
R100  10k  [RESC1005X40N]
R101  10k  [RESC1005X40N]
R102  10k  [RESC1005X40N]
R148  100  [RESC1005X40N]
R149  100  [RESC1005X40N]
R150  100  [RESC1005X40N]
R151  100  [RESC1005X40N]
R152  100  [RESC1005X40N]
R153  100  [RESC1005X40N]
R154  100  [RESC1005X40N]
R155  100  [RESC1005X40N]
R156  100  [RESC1005X40N]
R157  100  [RESC1005X40N]
R169  2k2  [RESC1005X40N]
R174  2k2  [RESC1005X40N]
R175  330  [RESC1005X40N]
R176  2k2  [RESC1005X40N]
R345  100  [RESC1005X40N]
R346  100  [RESC1005X40N]
R347  2k2  [RESC1005X40N]
R348  2k2  [RESC1005X40N]
R?#15  10k  [RESC1005X40N]
R?#16  100  [RESC1005X40N]
X1  QSDG8M000-TXC  [XTAL_5.0*3.2]

### Blocks framed on the sheet
Payload Management Latches: C?#4 D2#2 IC?#5 IC?#6 R7#1 R?#15
Debug/Programming Connections: D?#5 D?#6 JP2

### Ports
AMC_MMC (harness AMC_MMC), EN_I2C_RTM (out), FPGA_I2C (harness I2C), FPGA_RESETn (out), I2C (harness I2C), MISC1 (harness MISC), MISC2 (harness MISC), MMC_JTAG (harness MMC_JTAG), MOD_HANDLE (in), OVERTEMPn (bidir), PM_control (harness PM_control), RESETn (in), RTM_PS# (in), SPI_FPGA (harness SPI), SW, UI_MON (harness UI_MON), UPDATEn (out), USB_UART (harness USB_UART)

### Harnesses
SPI: SCK1, SSEL1, MISO1, MOSI1, FLASH_Q/D1, FLASH_SI/D0, PROGRAM_B, DONE, FPGA_CCLK, FCS_~{B}, INIT_B
MISC: PRSNT, PG_M2C, PG_C2M
I2C: SCL, SDA
MMC_JTAG: TCK, TDI, TDO, TMS, TRST_L
AMC_MMC: IPMB_SCL, IPMB_SDA, IPMB_GA0, IPMB_GA1, IPMB_GA2, ENABLE#
USB_UART: UART_DTR, UART_RTS, UART_RXD, UART_TXD
UI_MON: INA_CRITICAL, MEAS_1V0, MEAS_12V, MEAS_1V2, MEAS_3v3
PM_control: EN_P1V8, EN_P1V2, EN_FMC1_P12V, EN_FMC2_P12V, EN_FMC1_PVADJ, EN_FMC2_PVADJ, EN_FMC1_P3V3, EN_FMC2_P3V3, DAC_VADJ_CSn, DAC_VADJ_SDI, DAC_VADJ_CLK, DAC_VADJ_RSTn, 1V5_VTT_EN, EN_P1V0, PGOOD_P1V0, EN_P3V3, EN_RTM_PWR, EN_RTM_3V3MP

### Nets
GND: C18.1 C19.1 C21.1 C22.1 C23.1 C24.1 C25.1 C26.1 C27#1.1 C27#2.1 C28.1 C436.1 C437.1 C438.1 C439.1 C440.1 C441.1 C442.1 C443.1 C?#4.2 D?#5.1(I/O1) D?#5.2(GND) D?#5.3(I/O2) D?#5.4(I/O3) D?#6.2(GND) IC6.11(VSSA) IC6.15(VREFN) IC6.31(VSS) IC6.41(VSS) IC6.55(VSS) IC6.72(VSS) IC6.83(VSS) IC6.97(VSS) IC46.1(Vss) IC?#5.10(GND) IC?#6.10(GND) IC?#6.18(8D) JP2.3 JP2.5 JP2.9 Q15.6(D)
P3V3MP: C21.2 C22.2 C23.2 C24.2 C25.2 C26.2 C27#1.2 C436.2 C437.2 C438.2 C439.2 C440.2 C441.2 C442.2 C443.2 D2#2.1(C) D?#5.5(VBUS) D?#6.5(VBUS) IC6.19(VBAT) IC6.28(VDD(3V3)) IC6.42(VDD(REG)(3V3)) IC6.54(VDD(3V3)) IC6.71(VDD(3V3)) IC6.84(VDD(REG)(3V3)) IC6.96(VDD(3V3)) IC46.4(Vcc) IC?#5.20(VCC) IC?#6.20(VCC) JP2.1 L14.1 LD17.2(A) LDx.1(A) LDy.1(A) R1.1 R2.1 R3.1 R4.1 R47.1 R97.2 R98.2 R99.2 R100.2 R101.2 R102.2 R169.1 R174.1 R176.1 R347.1 R348.1 R?#15.2
Blue_LED: IC?#6.15(6Q) R23.1
DAC_VADJ_CLK: IC6.62(P0[15]/TXD1/SCK0/SCK) ; port PM_control.DAC_VADJ_CLK  [project net PM.DAC_VADJ_CLK]
DAC_VADJ_CSn: IC6.63(P0[16]/RXD1/SSEL0/SSEL) ; port PM_control.DAC_VADJ_CSn  [project net PM.DAC_VADJ_CSn]
DAC_VADJ_RSTn: IC6.57(P0[21]/RI1/RD1) ; port PM_control.DAC_VADJ_RSTn  [project net PM.DAC_VADJ_RSTn]
DAC_VADJ_SDI: IC6.60(P0[18]/DCD1/MOSI0/MOSI) ; port PM_control.DAC_VADJ_SDI  [project net PM.DAC_VADJ_SDI]
DONE: R153.2 ; port SPI_FPGA.DONE  [project net FSPI.DONE]
DONE_L: IC6.56(P0[22]/RTS1/TD1) R153.1
EN_1V5_VTT: IC?#5.6(3Q) ; port PM_control.1V5_VTT_EN  [project net PM.1V5_VTT_EN]
EN_FMC1_P3V3: IC?#5.16(7Q) ; port PM_control.EN_FMC1_P3V3  [project net PM.EN_FMC1_P3V3]
EN_FMC1_P12V: IC?#5.15(6Q) ; port PM_control.EN_FMC1_P12V  [project net PM.EN_FMC1_P12V]
EN_FMC1_PVADJ: IC?#5.19(8Q) ; port PM_control.EN_FMC1_PVADJ  [project net PM.EN_FMC1_PVADJ]
EN_FMC2_P3V3: IC?#6.5(2Q) ; port PM_control.EN_FMC2_P3V3  [project net PM.EN_FMC2_P3V3]
EN_FMC2_P12V: IC?#6.2(1Q) ; port PM_control.EN_FMC2_P12V  [project net PM.EN_FMC2_P12V]
EN_FMC2_PVADJ: IC?#6.6(3Q) ; port PM_control.EN_FMC2_PVADJ  [project net PM.EN_FMC2_PVADJ]
EN_I2C_RTM: IC6.30(P0[30]/USB_D-) ; port EN_I2C_RTM
EN_P1V0: IC?#5.2(1Q) ; port PM_control.EN_P1V0  [project net PM.EN_P1V0]
EN_P1V2: IC?#5.5(2Q) ; port PM_control.EN_P1V2  [project net PM.EN_P1V2]
EN_P1V8: IC?#5.9(4Q) ; port PM_control.EN_P1V8  [project net PM.EN_P1V8]
EN_P3V3: IC?#5.12(5Q) ; port PM_control.EN_P3V3  [project net PM.EN_P3V3]
EN_RTM_3V3MP: IC?#6.16(7Q) ; port PM_control.EN_RTM_3V3MP  [project net PM.EN_RTM_3V3MP]
EN_RTM_PWR: IC?#6.9(4Q) ; port PM_control.EN_RTM_PWR  [project net PM.EN_RTM_PWR]
ENABLE#: Q15.2(G) ; port AMC_MMC.ENABLE#  [project net IPMB.ENABLE#]
FCS_~{B}: R154.1 ; port SPI_FPGA.FCS_~{B}  [project net FSPI.FCS_~{B}]
FCS_~{B}_L: IC6.79(P0[6]/I2SRX_SDA/SSEL1/MAT2[0]) R154.2
FLASH_CS_MUX: R345.1
FLASH_CS_MUX_L: IC6.59(P0[19]/DSR1/SDA1) R345.2
FLASH_Q/D1: R156.1 ; port SPI_FPGA.FLASH_Q/D1  [project net FSPI.FLASH_Q/D1]
FLASH_Q/D1_L: IC6.77(P0[8]/I2STX_WS/MISO1/MAT2[2]) R156.2
FLASH_SI/D0: R157.1 ; port SPI_FPGA.FLASH_SI/D0  [project net FSPI.FLASH_SI/D0]
FLASH_SI/D0_L: IC6.76(P0[9]/I2STX_SDA/MOSI1/MAT2[3]) R157.2
Flip_Flop_CLK: C27#2.2 IC?#5.11(CLK) IC?#6.11(CLK) R?#16.2
FlipFlop_CLR: C?#4.1 IC?#5.1(~{CLR}) IC?#6.1(~{CLR}) R7#1.2 R?#15.1
FMC1_PG_C2M: R17.1 R98.1 ; port MISC1.PG_C2M  [project net MISC1.PG_C2M]
FMC1_PG_M2C: R15.1 R100.1 ; port MISC1.PG_M2C  [project net MISC1.PG_M2C]
FMC1_PRSNT_M2C_L: R13.1 R102.1 ; port MISC1.PRSNT  [project net MISC1.PRSNT]
FMC2_PG_C2M: R18.1 R97.1 ; port MISC2.PG_C2M  [project net MISC2.PG_C2M]
FMC2_PG_M2C: R16.1 R99.1 ; port MISC2.PG_M2C  [project net MISC2.PG_M2C]
FMC2_PRSNT_M2C_L: R14.1 R101.1 ; port MISC2.PRSNT  [project net MISC2.PRSNT]
FPGA_CCLK: R155.1 ; port SPI_FPGA.FPGA_CCLK  [project net FSPI.FPGA_CCLK]
FPGA_CCLK_L: IC6.78(P0[7]/I2STX_CLK/SCK1/MAT2[1]) R155.2
FPGA_MISO: R150.2 ; port SPI_FPGA.MISO1  [project net FSPI.MISO1]
FPGA_MOSI: R151.2 ; port SPI_FPGA.MOSI1  [project net FSPI.MOSI1]
FPGA_RESETn: IC?#6.12(5Q) ; port FPGA_RESETn
FPGA_SCK: R148.2 ; port SPI_FPGA.SCK1  [project net FSPI.SCK1]
FPGA_SCL: IC6.49(P0[11]/RXD2/SCL2/MAT3[1]) R348.2 ; port FPGA_I2C.SCL
FPGA_SDA: IC6.48(P0[10]/TXD2/SDA2/MAT3[0]) R347.2 ; port FPGA_I2C.SDA
FPGA_SSEL: R149.2 ; port SPI_FPGA.SSEL1  [project net FSPI.SSEL1]
GA0: R7#2.1 R20.1 ; port AMC_MMC.IPMB_GA0  [project net IPMB.IPMB_GA0]
GA1: R8.1 R21.1 ; port AMC_MMC.IPMB_GA1  [project net IPMB.IPMB_GA1]
GA2: R9.1 R22.1 ; port AMC_MMC.IPMB_GA2  [project net IPMB.IPMB_GA2]
Green_LED: IC6.90(P1[10]/ENET_RXD1) R24.1
INA_CRITICAL: IC6.39(P1[25]/MCOA1/MAT1[1]) ; port UI_MON.INA_CRITICAL  [project net UI_MON.INA_CRITICAL]
INIT_B: R346.1 ; port SPI_FPGA.INIT_B  [project net FSPI.INIT_B]
ISP_BOOT: IC6.53(P2[10]/~{EINT0}/NMI)
ISP_RST#: IC46.3(~{MR}) Q15.1(S) R2.2 ; port USB_UART.UART_DTR
MEAS_1V: IC6.8(P0[24]/AD0[1]/I2SRX_WS/CAP3[1])
MEAS_1V2: IC6.6(P0[26]/AD0[3]/AOUT/RXD3) ; port UI_MON.MEAS_1V2  [project net UI_MON.MEAS_1V2]
MEAS_3V3: IC6.7(P0[25]/AD0[2]/I2SRX_SDA/TXD3) ; port UI_MON.MEAS_3v3  [project net UI_MON.MEAS_3v3]
MEAS_12V: IC6.9(P0[23]/AD0[0]/I2SRX_CLK/CAP3[0]) ; port UI_MON.MEAS_12V  [project net UI_MON.MEAS_12V]
MMC_1V5_VTT_EN: IC6.45(P1[29]/MCOB2/PCAP1[1]/MAT0[1])
MMC_BLUE_LED: IC6.65(P2[8]/TD2/TXD2) IC?#6.14(6D)
MMC_EN_1V5_VTT: IC?#5.7(3D)
MMC_EN_FMC1_P3V3: IC6.74(P2[1]/PWM1[2]/RXD1) IC?#5.17(7D)
MMC_EN_FMC1_P12V: IC6.75(P2[0]/PWM1[1]/TXD1) IC?#5.14(6D)
MMC_EN_FMC1_PVADJ: IC6.73(P2[2]/PWM1[3]/CTS1/TRACEDATA[3]) IC?#5.18(8D)
MMC_EN_FMC2_P3V3: IC6.69(P2[4]/PWM1[5]/DSR1/TRACEDATA[1]) IC?#6.4(2D)
MMC_EN_FMC2_P12V: IC6.70(P2[3]/PWM1[4]/DCD1/TRACEDATA[2]) IC?#6.3(1D)
MMC_EN_FMC2_PVADJ: IC6.68(P2[5]/PWM1[6]/DTR1/TRACEDATA[0]) IC?#6.7(3D)
MMC_EN_P1V0: IC6.43(P1[27]/CLKOUT/~{USB_OVRCR}/CAP0[1]) IC?#5.3(1D)
MMC_EN_P1V2: IC6.44(P1[28]/MCOA2/PCAP1[0]/MAT0[0]) IC?#5.4(2D)
MMC_EN_P1V8: IC6.21(P1[30]/VBUS/AD0[4]) IC?#5.8(4D)
MMC_EN_P3V3: IC6.20(P1[31]/SCK1/AD0[5]) IC?#5.13(5D)
MMC_EN_RTM_3V3MP: IC6.82(P4[28]/RX_MCLK/MAT2[0]/TXD3) IC?#6.17(7D)
MMC_EN_RTM_PWR: IC6.67(P2[6]/PCAP1[0]/RI1/TRACECLK) IC?#6.8(4D)
MMC_FPGA_RESETn: IC6.66(P2[7]/RD2/RTS1) IC?#6.13(5D)
MMC_TCK: JP2.4 ; port MMC_JTAG.TCK
MMC_TDI: JP2.8 ; port MMC_JTAG.TDI
MMC_TDO: JP2.6 ; port MMC_JTAG.TDO
MMC_TMS: JP2.2 ; port MMC_JTAG.TMS
MMC_TRST_L: JP2.10 ; port MMC_JTAG.TRST_L
MOD_HANDLE: IC6.50(P2[13]/~{EINT3}/I2STX_SDA) ; port MOD_HANDLE
MP_XTAL1: C18.2 IC6.22(XTAL1) X1.1
MP_XTAL2: C19.2 IC6.23(XTAL2) X1.2
OVERTEMPn: IC6.52(P2[11]/~{EINT1}/I2STX_CLK) ; port OVERTEMPn  [project net FPGA_ALERTn]
P1: R10.1 R20.2 R21.2 R22.2
P2_BLUE: LDy.2(C) R23.2
P3_GREEN: LDx.2(C) R24.2
P3V3MP_LAVCC: C28.2 IC6.10(VDDA) IC6.12(VREFP) L14.2
P4_RED: LD17.1(C) R175.2
PGOOD_1V0: IC6.26(P3[26]/STCLK/MAT0[1]/PWM1[3]) ; port PM_control.PGOOD_P1V0  [project net PM.PGOOD_P1V0]
PROG_RxD: IC6.99(P0[3]/RXD0/AD0[6]) ; port USB_UART.UART_TXD
PROG_TxD: IC6.98(P0[2]/TXD0/AD0[7]) ; port USB_UART.UART_RXD
PROGRAM_B: R152.2 ; port SPI_FPGA.PROGRAM_B  [project net FSPI.PROGRAM_B]
PROGRAM_B_L: IC6.61(P0[17]/CTS1/MISO0/MISO) R152.1
Red_LED: IC6.91(P1[9]/ENET_RXD0) R175.1
RESET#: IC6.17(~{RESET}) IC46.2(~{RST})
RESETn: IC6.36(P1[22]/MCOB0/USB_PWRD/MAT1[0]) ; port RESETn
RTM_PS#: IC6.27(P3[25]/MAT0[0]/PWM1[2]) ; port RTM_PS#
SCL0: IC6.24(P0[28]/SCL0/USB_SCL) R47.2
SDA0: IC6.25(P0[27]/SDA0/USB_SDA) R169.2
SW: IC6.51(P2[12]/~{EINT2}/I2STX_WS) ; port SW
SWO/TDO: D?#6.4(I/O3) IC6.1(TDO/SWO) R3.2
TCK/SWDCLK: D?#6.3(I/O2) IC6.5(TCK/SWDCLK) R1.2
TDI: D?#6.6(I/O4) IC6.2(TDI)
temp_SCL: IC6.47(P0[1]/TD1/RXD3/SCL1) R176.2 ; port I2C.SCL  [project net I2C_CPU.SCL]
temp_SDA: IC6.46(P0[0]/RD1/TXD3/SDA1) R174.2 ; port I2C.SDA  [project net I2C_CPU.SDA]
TMS/SWDIO: D?#6.1(I/O1) IC6.3(TMS/SWDIO)
TRST_L/nRESET: D?#5.6(I/O4) IC6.4(~{TRST}) R4.2
UPDATEn: IC6.40(P1[26]/MCOB1/PWM1[6]/CAP0[0]) ; port UPDATEn
NetD2#2_2: D2#2.2(A) R7#1.1
NetIC6_32: IC6.32(P1[18]/USB_UP_LED/PWM1[1]/CAP1[0]) R17.2
NetIC6_33: IC6.33(P1[19]/MCOA0/~{USB_PPWR}/CAP1[1]) R18.2
NetIC6_34: IC6.34(P1[20]/MCI0/PWM1[2]/SCK0) R148.1
NetIC6_35: IC6.35(P1[21]/~{MCABORT}/PWM1[3]/SSEL0) R149.1
NetIC6_37: IC6.37(P1[23]/MCI1/PWM1[4]/MISO0) R150.1
NetIC6_38: IC6.38(P1[24]/MCI2/PWM1[5]/MOSI0) R151.1
NetIC6_58: IC6.58(P0[20]/DTR1/SCL1) R346.2
NetIC6_64: IC6.64(P2[9]/USB_CONNECT/RXD2) R?#16.1
NetIC6_86: IC6.86(P1[17]/ENET_MDIO) R16.2
NetIC6_87: IC6.87(P1[16]/ENET_MDC) R15.2
NetIC6_88: IC6.88(P1[15]/ENET_REF_CLK) R14.2
NetIC6_89: IC6.89(P1[14]/ENET_RX_ER) R13.2
NetIC6_92: IC6.92(P1[8]/ENET_CRS) R10.2
NetIC6_93: IC6.93(P1[4]/ENET_TX_EN) R9.2
NetIC6_94: IC6.94(P1[1]/ENET_TXD1) R8.2
NetIC6_95: IC6.95(P1[0]/ENET_TXD0) R7#2.2

Not connected (* = marked no-connect by the designer): IC6 13(NC)* 14(~{RSTOUT})* 16(RTCX1)* 18(RTCX2)* 29(P0[29]/USB_D+) 80(P0[5]/I2SRX_WS/TD2/CAP2[1]) 81(P0[4]/I2SRX_CLK/RD2/CAP2[0]) 85(P4[29]/TX_MCLK/MAT2[1]/RXD3) 100(RTCK)*; IC?#6 19(8Q)*; JP2 7*

### Layout directives
net class SE_SIG: DONE_L, DONE_R, FCS_~{B}_L, FCS_~{B}_R, FLASH_Q/D1_L, FLASH_Q/D1_R, FLASH_SI/D0_L, FLASH_SI/D0_R, FPGA_CCLK_L, FPGA_CCLK_R, PROGRAM_B_L, PROGRAM_B_R
net class SE50: DONE_L, DONE_R, FCS_~{B}_L, FCS_~{B}_R, FLASH_Q/D1_L, FLASH_Q/D1_R, FLASH_SI/D0_L, FLASH_SI/D0_R, FPGA_CCLK_L, FPGA_CCLK_R, PROGRAM_B_L, PROGRAM_B_R
net class POWER: P3V3MP, P3V3MP_LAVCC

### Notes on the sheet
- (near C?#4) Delay to guarantee all FF outputs will be 0 when MP starts
- Flip Flops allow the MMC to reset (or maybe even being reprogrammed), without affecting payload.
- (near R4) Pull Up/Down from https://community.nxp.com/thread/388998.
  TDI and TMS have internal pull ups.
  TCK also has a pull-up, so pulling down is avoided.
- verify crystal load capacitances
  39pF for crystals Rs >100R
- Access Area 		Bit 7 Bit 6 Bit 5 Bit 4 Bit 3 Bit 2 Bit 1 Bit 0
  EEPROM 			1       0       1       0      A2     A1    A0    R/W
  EUI or Serial Number Read 	1       0       1       1      A2     A1    A0      1
- Copyright CNPEM 2012.
  This documentation describes Open Hardware and is licensed under the CERN OHL v.1.1. You may redistribute and modify this documentation under the terms of the CERN OHL v.1.1. (http://ohwr.org/CERNOHL). This documentation is distributed WITHOUT ANY EXPRESS OR IMPLIED WARRANTY, INCLUDING OF MERCHANTABILITY, SATISFACTORY QUALITY AND FITNESS FOR A PARTICULAR PURPOSE. Please see the CERN OHL v.1.1 for applicable conditions.
- Labels drawn without touching a wire or pin: SWO/TDO, TCK/SWDCLK, TDI, TMS/SWDIO, TRST_L/nRESET
- (in symbol PMGD280UN, part A) 1(S); 2(G); 6(D)
- (in symbol R0402_2K2_1%_0.0625W_100PPM) 1%
- (in symbol R0402_4K7_1%_0.0625W_100PPM) 1%
- (in symbol R0402_10K_1%_0.0625W_100PPM) 1%
- (in symbol R0402_100R_1%_0.0625W_100PPM) 1%
- (in symbol R0402_330R_1%_0.0625W_100PPM) 1%
- (in symbol LED_AVAGO_HSME-C120) Green

### Library data of the parts
C18 C19 = CC0402_22PF_50V_5%_NP0: Non-polarised capacitor; Part Description: SMD Multilayer Chip Ceramic Capacitor; Manufacturer: GENERIC; Manufacturer1 Part Number: 223886915229; Voltage: 50V; TC: NP0; Tolerance: ±5%; Table: Capacitors SMD; Part Number: CC0402_22PF_50V_5%_NP0; Component Kind: Standard; Component Type: Standard; Pin Count: 2; Value: 22pF; Status: Not Recommended; Manufacturer Part Number: CC0402_22PF_50V_5%_NP0; Case: 0402; Mounted: Yes; Socket: No; SMD: Yes; Manufacturer1 Example: PHYCOMP; Manufacturer1 ComponentHeight: 0.55mm; HelpURL: \\cern.ch\dfs\Applications\Altium\Datasheets\CC0402_NP0_PHYCOMP.pdf; Author: CERN DEM JLC; CreateDate: 2007-12-03; LatestRevisionDate: 2007-12-03
C21-C26 C27#1 C27#2 C28 C436-C443 = CC0201_100NF_6.3V_10%_X5R: as C616-C621 on sheet UI_mon; Part Number: CC0201_100NF_6.3V_10%_X5R; Component Kind: Standard; Component Type: Standard; Pin Count: 2; Value: 100nF; Status: Not Recommended; Manufacturer Part Number: CC0201_100NF_6.3V_10%_X5R; Case: 0201; Mounted: Yes; Socket: No; SMD: Yes; Manufacturer1 Example: AVX; Manufacturer1 ComponentHeight: 0.33mm; HelpURL: \\cern.ch\dfs\Applications\Altium\Datasheets\CC0201_X5R_AVX.pdf; Author: CERN DEM JLC; CreateDate: 2007-12-03; LatestRevisionDate: 2007-12-03
C?#4 = CC0603_1UF_16V_10%_X7R: Non-polarised capacitor; Part Description: SMD Multilayer Chip Ceramic Capacitor; Manufacturer: GENERIC; Manufacturer1 Part Number: 223824613663; Voltage: 16V; TC: X7R; Tolerance: ±10%; Table: Capacitors SMD; Part Number: CC0603_1UF_16V_10%_X7R; Component Kind: Standard; Component Type: Standard; Pin Count: 2; Value: 1uF; Status: Preferred; Manufacturer Part Number: CC0603_1uF_16V_10%_X7R; Case: 0603; Mounted: Yes; Socket: No; SMD: Yes; Manufacturer1 Example: PHYCOMP; Manufacturer1 ComponentHeight: 0.87mm; HelpURL: \\cern.ch\dfs\Applications\Altium\Datasheets\CC0805_X5R_PHYCOMP_HC.pdf; Author: CERN DEM JLC; CreateDate: 2007-12-03; LatestRevisionDate: 2007-12-03
D2#2 = SS16: Schottky Diode; Part Description: Surface Mount Schottky Barrier Rectifier; Manufacturer: VISHAY GENERAL SEMICONDUCTOR; Voltage: 60V; Power: 1A; Table: Diodes; Part Number: SS16; Component Kind: Standard; Component Type: Standard; Device: SS16; PackageDescription: DO-214-AC Molded Diode, Body 5.1x2.7mm, IPC Medium Density; Manufacturer Part Number: SS16; Pin Count: 2; Case: DO-214AC; Mounted: Yes; Socket: No; SMD: Yes; ComponentHeight: 2.29mm; HelpURL: \\cern.ch\dfs\Applications\Altium\Datasheets\SS16.pdf; Author: CERN DEM JLC; CreateDate: 2008-07-15; LatestRevisionDate: 2010-08-23
D?#5 D?#6 = NUP4114UPXV6T1G: Part Description: ESD Protection Diodes Array (8kV) with Low Clamping Voltage; Manufacturer: ON SEMICONDUCTOR; Voltage: 5.5V; PressFit: No; Bonding: No; Part Number: NUP4114UPXV6T1G; Component Kind: Standard; Component Type: Standard; Device: NUP4114UPXV6T1G; PackageDescription: SOTFL (SOT666, SOT563,), 0.50mm, Pitch; 6 Pin, 1.20mm W X 1.60mm L X 0.60mm H Body, IPC Medium Density; Manufacturer Part Number: NUP4114UPXV6T1G; Pin Count: 8; Mounted: Yes; Socket: No; SMD: Yes; Sense: No; ComponentHeight: 1.75mm; HelpURL: \\cern.ch\dfs\Applications\Altium\Datasheets\NUP4114UPXV6T1G.pdf; Author: CERN DEM JLC; CreateDate: 05/12/2012; LatestRevisionDate: 05/12/2012
IC6 = LPC1768FBD100: LPC1768 Series 64kB 100MHz 32-Bit ARM Cortex-M3 Microcontroller; Part Description: 32-bit 100MHz ARM Cortex-M3 Microcontroller, 512kB Flash, 64kB SRAM, with Ethernet, USB 2.0 Host/Device/OTG, CAN; Manufacturer: NXP SEMICONDUCTORS; PressFit: No; Bonding: No; Part Number: LPC1768FBD100; Component Kind: Standard; Component Type: Standard; Device: LPC1768FBD100; PackageDescription: QFP, 0.50mm Pitch, Square; 100 Pin,14.00mm L X 14.00mm W X 1.60mm H Body, IPC Medium Density; Manufacturer Part Number: LPC1768FBD100; Pin Count: 100; Case: QFP100; Mounted: Yes; Socket: No; SMD: Yes; Sense: No; ComponentHeight: 1.6mm; HelpURL: \\cern.ch\dfs\Applications\Altium\Datasheets\LPC1768FBD100.pdf; Author: CERN DEM JLC; CreateDate: 06/10/2016; LatestRevisionDate: 06/10/2016
IC46 = STM811: Triple-Channel, High-Side Measurement, Shunt and Bus Voltage Monitor  with I  2C™ Interface
IC?#5 IC?#6 = SN74LV273A: Octal D-Type Flip-Flops With Clear
JP2 = CON_HEADER 5X2: PBTD10S
L14 = IND0805_MURATA_BLM21PG221SN1D: as L?#1 on sheet UI_mon; Part Number: IND0805_MURATA_BLM21PG221SN1D; Component Kind: Standard; Component Type: Standard; Pin Count: 2; Value: 220R@100MHz; Status: None; Manufacturer Part Number: BLM21PG221SN1D; Case: 0805; Mounted: Yes; Socket: No; SMD: Yes; ComponentHeight: 1.05mm; HelpURL: \\cern.ch\dfs\Applications\Altium\Datasheets\IND0402_MURATA_BLM21P.pdf; Author: CERN DEM JLC; CreateDate: 2010-01-25; LatestRevisionDate: 2010-01-25
LD17 = LED_AVAGO_HSMC-C150: as LED6#3 on sheet Connector_Power; Part Number: LED_AVAGO_HSMC-C150; Component Kind: Standard; Component Type: Standard; Color: Red; PackageDescription: Red Chip LED, 2-Leads, Body 3.2 x1.6mm, IPC Medium Density; Manufacturer Part Number: HSMC-C150; Pin Count: 2; Case: 1206; Mounted: Yes; Socket: No; SMD: Yes; Sense: No; ComponentHeight: 1.2mm; HelpURL: \\cern.ch\dfs\Applications\Altium\Datasheets\LED_AVAGO_HSMC-C150.pdf; Author: CERN DEM JLC; CreateDate: 18/06/2013; LatestRevisionDate: 18/06/2013
LDx = LED_SMD_90deg_mini_G: LED Green Avago C120; Part Number: LED_AVAGO_HSME-C120; Part Description: High Performance Right Angle Chip Green LED; Manufacturer: AVAGO TECHNOLOGIES; Manufacturer Part Number: HSME-C120; Table: LEDs & Displays; Component Kind: Standard; Component Type: Standard; Color: Green; Footprint: LED_AVAGO_HSME-C120; PackageDescription: Green Chip LED, 2-Leads, Body 1.7x1.1mm, Side Emitting Package; Pin Count: 2; Mounted: Yes; Socket: No; SMD: Yes; ComponentHeight: 0.7mm; HelpURL: \\cern.ch\dfs\Applications\Altium\Datasheets\LED_AVAGO_HSME-C120.pdf; ComponentLink1URL: \\cern.ch\dfs\Applications\Altium\Datasheets\LED_AVAGO_HSME-C110_DESIGN-GUIDE.pdf; ComponentLink1Description: Design Guide; Author: CERN DEM JMW; CreateDate: 2009-07-22; LatestRevisionDate: 2012-06-20
LDy = LED_SMD_90deg_mini_B: LED Blue Avago C120; Part Number: LED_AVAGO_HSMR-C120; Part Description: High Performance Right Angle Chip Blue LED; Manufacturer: AVAGO TECHNOLOGIES; Manufacturer Part Number: HSMR-C120; Table: LEDs & Displays; Component Kind: Standard; Component Type: Standard; Color: Blue; Footprint: LED_AVAGO_HSMR-C120; PackageDescription: Blue Chip LED, 2-Leads, Body 1.7x1.1mm, Side Emitting Package; Pin Count: 2; Mounted: Yes; Socket: No; SMD: Yes; ComponentHeight: 0.7mm; HelpURL: \\cern.ch\dfs\Applications\Altium\Datasheets\LED_AVAGO_HSME-C120.pdf; ComponentLink1URL: \\cern.ch\dfs\Applications\Altium\Datasheets\LED_AVAGO_HSME-C110_DESIGN-GUIDE.pdf; ComponentLink1Description: Design Guide; Author: CERN DEM JMW; CreateDate: 2009-07-22; LatestRevisionDate: 2012-06-20
Q15 = PMGD280UN: Dual N-Channel micro TrenchMOS™ Ultra Low Level FET; Manufacturer: NXP SEMICONDUCTORS; Part Description: 20V 870mA Dual N-Channel micro TrenchMOS™ Ultra Low Level FET; Bonding: No; PressFit: No; Part Number: PMGD280UN; Author: CERN DEM JLC; Case: SOT363; ComponentHeight: 1.1mm; Component Type: Standard; CreateDate: 19/11/2014; Device: PMGD280UN; HelpURL: \\cern.ch\dfs\Applications\Altium\Datasheets\PMGD280UN.pdf; LatestRevisionDate: 19/11/2014; Manufacturer Part Number: PMGD280UN; Mounted: Yes; PackageDescription: SOT363, SC70-6, SOT, 0.65mm Pitch, 6 pin, 1.25mm W X 2.00mm L X 1.10mm H, IPC Medium Density; Pin Count: 6; Sense: No; SMD: Yes; Socket: No
R1-R4 R97-R102 R?#15 = R0402_10K_1%_0.0625W_100PPM: as R147 on sheet UI_mon; Part Number: R0402_10K_1%_0.0625W_100PPM; Component Kind: Standard; Component Type: Standard; Pin Count: 2; Value: 10k; Status: Not recommended; Power: 0.0625W; Tolerance: ±1%; Manufacturer Part Number: R0402_10K_1%_0.0625W_100PPM; Case: 0402; Mounted: Yes; Socket: No; SMD: Yes; Manufacturer1 Example: YAGEO PHYCOMP; Manufacturer1 ComponentHeight: 0.4mm; HelpURL: \\cern.ch\dfs\Applications\Altium\Datasheets\R0402_Phycomp_RC0402.pdf; Author: CERN DEM JLC; CreateDate: 2007-12-03; LatestRevisionDate: 2012-10-17
R7#1 R7#2 R8-R10 R13-R18 R148-R157 R345 R346 R?#16 = R0402_100R_1%_0.0625W_100PPM: Resistor - 1%; Part Description: General Purpose Thick Film Chip Resistor; Manufacturer: GENERIC; Manufacturer1 Part Number: 232270671001L; TC: ±100ppm/°C; Table: Resistors SMD; Part Number: R0402_100R_1%_0.0625W_100PPM; Component Kind: Standard; Component Type: Standard; Pin Count: 2; Value: 100; Status: Not recommended; Power: 0.0625W; Tolerance: ±1%; Manufacturer Part Number: R0402_100R_1%_0.0625W_100PPM; Case: 0402; Mounted: Yes; Socket: No; SMD: Yes; Manufacturer1 Example: YAGEO PHYCOMP; Manufacturer1 ComponentHeight: 0.4mm; HelpURL: \\cern.ch\dfs\Applications\Altium\Datasheets\R0402_Phycomp_RC0402.pdf; Author: CERN DEM JLC; CreateDate: 2007-12-03; LatestRevisionDate: 2012-10-17
R20-R22 = R0402_4K7_1%_0.0625W_100PPM: Resistor - 1%; Part Description: General Purpose Thick Film Chip Resistor; Manufacturer: GENERIC; Manufacturer1 Part Number: 232270674702L; TC: ±100ppm/°C; Table: Resistors SMD; Part Number: R0402_4K7_1%_0.0625W_100PPM; Component Kind: Standard; Component Type: Standard; Pin Count: 2; Value: 4k7; Status: Not recommended; Power: 0.0625W; Tolerance: ±1%; Manufacturer Part Number: R0402_4K7_1%_0.0625W_100PPM; Case: 0402; Mounted: Yes; Socket: No; SMD: Yes; Manufacturer1 Example: YAGEO PHYCOMP; Manufacturer1 ComponentHeight: 0.4mm; HelpURL: \\cern.ch\dfs\Applications\Altium\Datasheets\R0402_Phycomp_RC0402.pdf; Author: CERN DEM JLC; CreateDate: 2007-12-03; LatestRevisionDate: 2012-10-17
R23 R24 R175 = R0402_330R_1%_0.0625W_100PPM: Resistor - 1%; Part Description: General Purpose Thick Film Chip Resistor; Manufacturer: GENERIC; Manufacturer1 Part Number: 232270673301L; TC: ±100ppm/°C; Table: Resistors SMD; Part Number: R0402_330R_1%_0.0625W_100PPM; Component Kind: Standard; Component Type: Standard; Pin Count: 2; Value: 330; Status: Not recommended; Power: 0.0625W; Tolerance: ±1%; Manufacturer Part Number: R0402_330R_1%_0.0625W_100PPM; Case: 0402; Mounted: Yes; Socket: No; SMD: Yes; Manufacturer1 Example: YAGEO PHYCOMP; Manufacturer1 ComponentHeight: 0.4mm; HelpURL: \\cern.ch\dfs\Applications\Altium\Datasheets\R0402_Phycomp_RC0402.pdf; Author: CERN DEM JLC; CreateDate: 2007-12-03; LatestRevisionDate: 2012-10-17
R47 R169 R174 R176 R347 R348 = R0402_2K2_1%_0.0625W_100PPM: as R?#8 on sheet UI_mon; Part Number: R0402_2K2_1%_0.0625W_100PPM; Component Kind: Standard; Component Type: Standard; Pin Count: 2; Value: 2k2; Status: Not recommended; Power: 0.0625W; Tolerance: ±1%; Manufacturer Part Number: R0402_2K2_1%_0.0625W_100PPM; Case: 0402; Mounted: Yes; Socket: No; SMD: Yes; Manufacturer1 Example: YAGEO PHYCOMP; Manufacturer1 ComponentHeight: 0.4mm; HelpURL: \\cern.ch\dfs\Applications\Altium\Datasheets\R0402_Phycomp_RC0402.pdf; Author: CERN DEM JLC; CreateDate: 2007-12-03; LatestRevisionDate: 2012-10-17
X1 = X_CRYSTAL_SMD_5.0*3.2: miniature crystal oscillator (Maritex) QSDG8M000-TXC